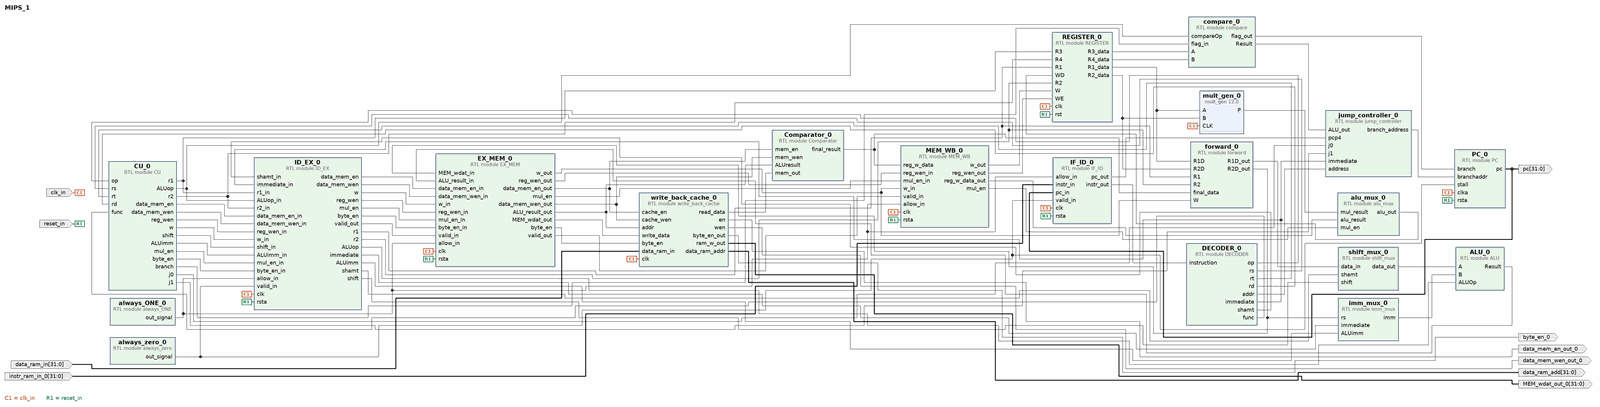
[diagram p0: block diagram of the top level, whole]
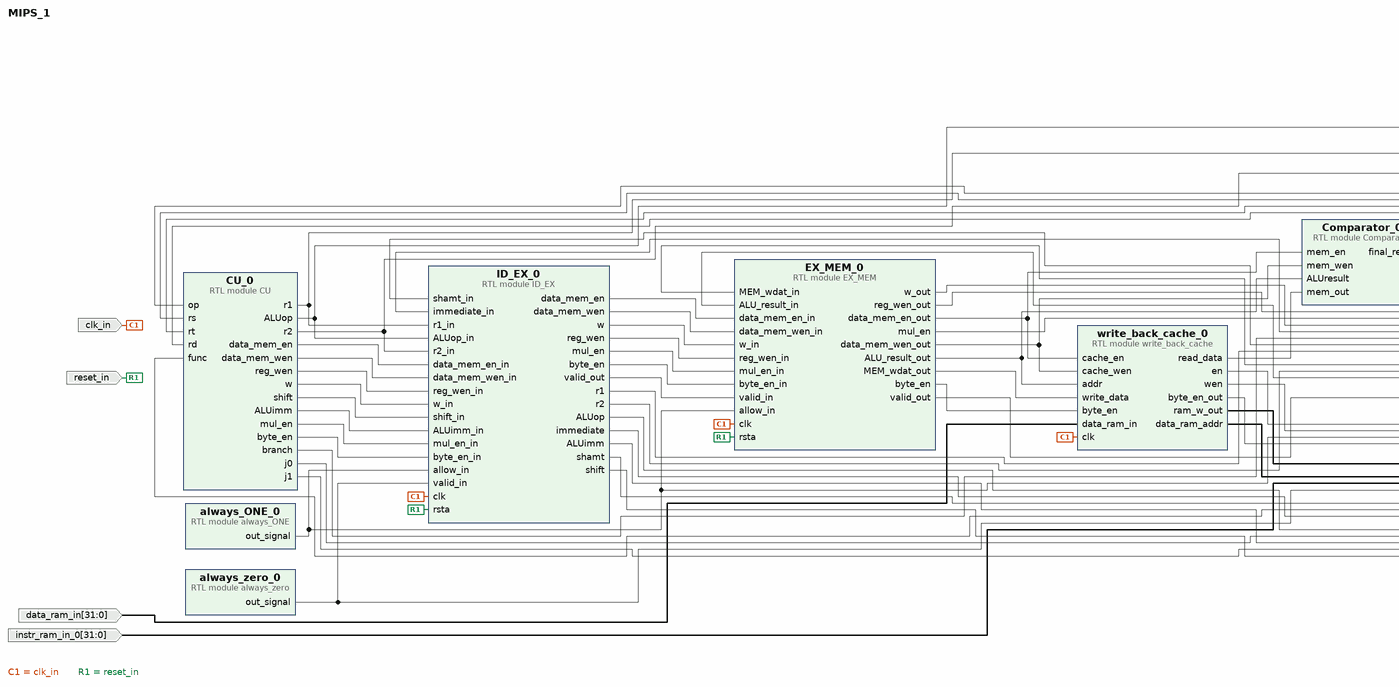
[diagram p1: block diagram of the top level, left part]
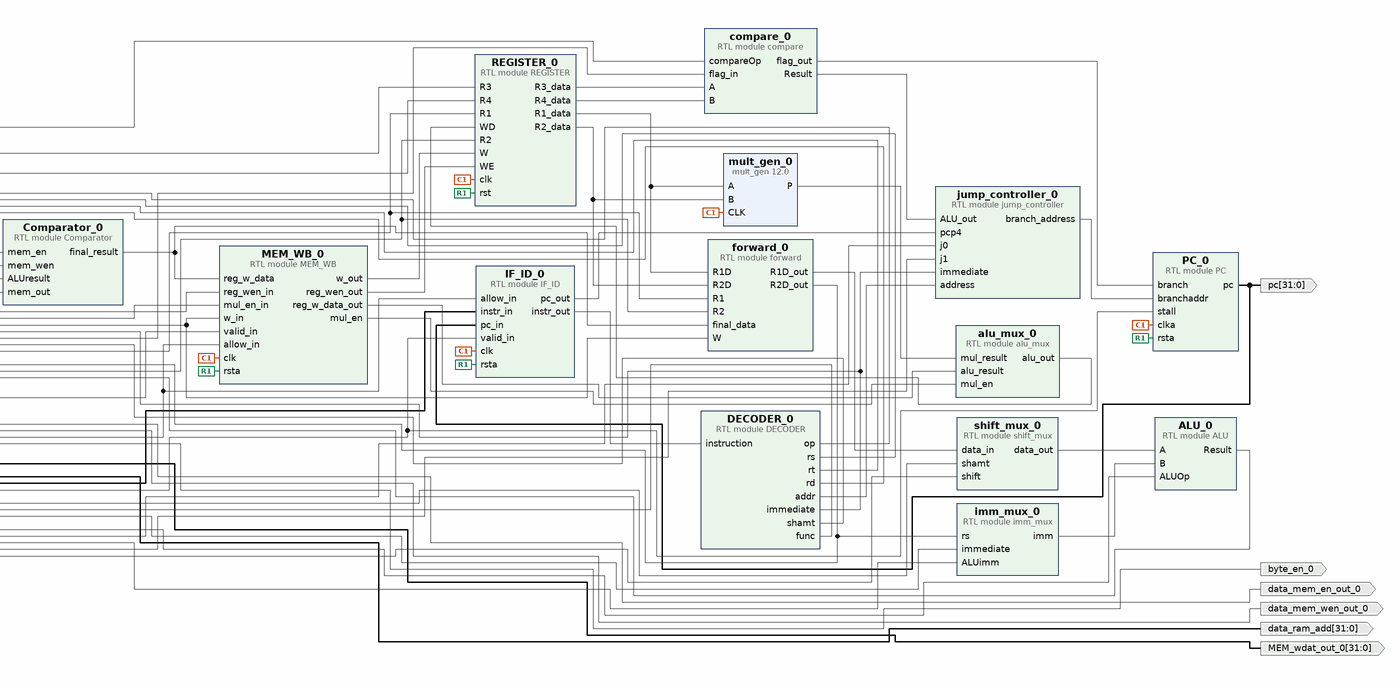
[diagram p2: block diagram of the top level, right part]
# Vivado block design MIPS_1, xc7z020clg400-2, Vivado 2018.3
create_bd_design MIPS_1

create_bd_port -dir I -type rst reset_in
set_property -dict {CONFIG.POLARITY ACTIVE_HIGH} [get_bd_ports reset_in]
create_bd_port -dir I -type clk clk_in
set_property -dict {CONFIG.FREQ_HZ 50000000} [get_bd_ports clk_in]
create_bd_port -dir O -from 31 -to 0 pc
create_bd_port -dir I -from 31 -to 0 instr_ram_in_0
create_bd_port -dir O -from 31 -to 0 data_ram_add
create_bd_port -dir I -from 31 -to 0 data_ram_in
create_bd_port -dir O -from 31 -to 0 MEM_wdat_out_0
create_bd_port -dir O data_mem_en_out_0
create_bd_port -dir O data_mem_wen_out_0
create_bd_port -dir O byte_en_0

create_bd_cell -type module -reference imm_mux imm_mux_0
create_bd_cell -type module -reference shift_mux shift_mux_0
create_bd_cell -type module -reference always_zero always_zero_0
create_bd_cell -type module -reference jump_controller jump_controller_0
create_bd_cell -type module -reference forward forward_0
create_bd_cell -type module -reference Comparator Comparator_0
create_bd_cell -type module -reference PC PC_0
create_bd_cell -type module -reference ALU ALU_0
create_bd_cell -type module -reference alu_mux alu_mux_0
create_bd_cell -type ip -vlnv xilinx.com:ip:mult_gen:12.0 mult_gen_0
set_property -dict [list \
  CONFIG.ClockEnable false \
  CONFIG.Multiplier_Construction Use_LUTs \
  CONFIG.OutputWidthHigh 31 \
  CONFIG.PipeStages 2 \
  CONFIG.PortAType Signed \
  CONFIG.PortAWidth 32 \
  CONFIG.PortBType Signed \
  CONFIG.PortBWidth 32 \
  CONFIG.Use_Custom_Output_Width true \
] [get_bd_cells mult_gen_0]
create_bd_cell -type module -reference DECODER DECODER_0
create_bd_cell -type module -reference REGISTER REGISTER_0
create_bd_cell -type module -reference CU CU_0
create_bd_cell -type module -reference write_back_cache write_back_cache_0
create_bd_cell -type module -reference always_ONE always_ONE_0
create_bd_cell -type module -reference compare compare_0
create_bd_cell -type module -reference ID_EX ID_EX_0
create_bd_cell -type module -reference MEM_WB MEM_WB_0
create_bd_cell -type module -reference IF_ID IF_ID_0
create_bd_cell -type module -reference EX_MEM EX_MEM_0

# ---- connections ----

connect_bd_net -net Clock_Gate_0_clk_out [get_bd_ports clk_in] \
  [get_bd_pins PC_0/clka] [get_bd_pins mult_gen_0/CLK] [get_bd_pins REGISTER_0/clk] [get_bd_pins write_back_cache_0/clk] \
  [get_bd_pins ID_EX_0/clk] [get_bd_pins MEM_WB_0/clk] [get_bd_pins IF_ID_0/clk] [get_bd_pins EX_MEM_0/clk]
connect_bd_net [get_bd_pins DECODER_0/op] [get_bd_pins CU_0/op]
connect_bd_net [get_bd_pins DECODER_0/rs] [get_bd_pins CU_0/rs]
connect_bd_net [get_bd_pins DECODER_0/rt] [get_bd_pins CU_0/rt]
connect_bd_net [get_bd_pins DECODER_0/rd] [get_bd_pins CU_0/rd]
connect_bd_net [get_bd_pins CU_0/data_mem_en] [get_bd_pins ID_EX_0/data_mem_en_in]
connect_bd_net [get_bd_pins CU_0/data_mem_wen] [get_bd_pins ID_EX_0/data_mem_wen_in]
connect_bd_net [get_bd_pins CU_0/reg_wen] [get_bd_pins ID_EX_0/reg_wen_in]
connect_bd_net [get_bd_pins CU_0/r1] [get_bd_pins REGISTER_0/R3] [get_bd_pins ID_EX_0/r1_in]
connect_bd_net [get_bd_pins CU_0/r2] [get_bd_pins REGISTER_0/R4] [get_bd_pins ID_EX_0/r2_in]
connect_bd_net [get_bd_pins CU_0/w] [get_bd_pins ID_EX_0/w_in]
connect_bd_net [get_bd_pins CU_0/ALUop] [get_bd_pins compare_0/compareOp] [get_bd_pins ID_EX_0/ALUop_in]
connect_bd_net [get_bd_pins CU_0/shift] [get_bd_pins ID_EX_0/shift_in]
connect_bd_net [get_bd_pins CU_0/ALUimm] [get_bd_pins ID_EX_0/ALUimm_in]
connect_bd_net [get_bd_pins DECODER_0/func] [get_bd_pins CU_0/func]
connect_bd_net [get_bd_pins DECODER_0/shamt] [get_bd_pins ID_EX_0/shamt_in]
connect_bd_net [get_bd_pins DECODER_0/immediate] [get_bd_pins jump_controller_0/immediate] [get_bd_pins ID_EX_0/immediate_in]
connect_bd_net [get_bd_pins DECODER_0/addr] [get_bd_pins jump_controller_0/address]
connect_bd_net [get_bd_pins ID_EX_0/r1] [get_bd_pins forward_0/R1] [get_bd_pins REGISTER_0/R1]
connect_bd_net [get_bd_pins ID_EX_0/r2] [get_bd_pins forward_0/R2] [get_bd_pins REGISTER_0/R2]
connect_bd_net [get_bd_pins ID_EX_0/ALUop] [get_bd_pins ALU_0/ALUOp]
connect_bd_net [get_bd_pins ID_EX_0/immediate] [get_bd_pins imm_mux_0/immediate]
connect_bd_net [get_bd_pins ID_EX_0/ALUimm] [get_bd_pins imm_mux_0/ALUimm]
connect_bd_net [get_bd_pins imm_mux_0/imm] [get_bd_pins ALU_0/B]
connect_bd_net [get_bd_pins shift_mux_0/data_out] [get_bd_pins ALU_0/A]
connect_bd_net [get_bd_pins ID_EX_0/shamt] [get_bd_pins shift_mux_0/shamt]
connect_bd_net [get_bd_pins ID_EX_0/shift] [get_bd_pins shift_mux_0/shift]
connect_bd_net [get_bd_pins ID_EX_0/data_mem_en] [get_bd_pins EX_MEM_0/data_mem_en_in]
connect_bd_net [get_bd_pins ID_EX_0/data_mem_wen] [get_bd_pins EX_MEM_0/data_mem_wen_in]
connect_bd_net [get_bd_pins ID_EX_0/w] [get_bd_pins EX_MEM_0/w_in]
connect_bd_net [get_bd_pins ID_EX_0/reg_wen] [get_bd_pins EX_MEM_0/reg_wen_in]
connect_bd_net [get_bd_pins Comparator_0/final_result] [get_bd_pins forward_0/final_data] [get_bd_pins MEM_WB_0/reg_w_data]
connect_bd_net [get_bd_pins EX_MEM_0/w_out] [get_bd_pins forward_0/W] [get_bd_pins MEM_WB_0/w_in]
connect_bd_net [get_bd_pins EX_MEM_0/reg_wen_out] [get_bd_pins MEM_WB_0/reg_wen_in]
connect_bd_net [get_bd_pins MEM_WB_0/w_out] [get_bd_pins REGISTER_0/W]
connect_bd_net [get_bd_pins MEM_WB_0/reg_wen_out] [get_bd_pins REGISTER_0/WE]
connect_bd_net [get_bd_pins IF_ID_0/instr_out] [get_bd_pins DECODER_0/instruction]
connect_bd_net [get_bd_pins always_zero_0/out_signal] [get_bd_pins PC_0/stall] [get_bd_pins ID_EX_0/valid_in] [get_bd_pins IF_ID_0/valid_in]
connect_bd_net [get_bd_pins PC_0/pc] [get_bd_ports pc] [get_bd_pins IF_ID_0/pc_in]
connect_bd_net -net instr_in_0_1 [get_bd_ports instr_ram_in_0] [get_bd_pins IF_ID_0/instr_in]
connect_bd_net [get_bd_pins EX_MEM_0/data_mem_en_out] [get_bd_pins Comparator_0/mem_en] [get_bd_pins write_back_cache_0/cache_en]
connect_bd_net [get_bd_pins EX_MEM_0/data_mem_wen_out] [get_bd_pins Comparator_0/mem_wen] [get_bd_pins write_back_cache_0/cache_wen]
connect_bd_net [get_bd_pins REGISTER_0/R1_data] [get_bd_pins forward_0/R1D] [get_bd_pins mult_gen_0/A]
connect_bd_net [get_bd_pins REGISTER_0/R2_data] [get_bd_pins forward_0/R2D] [get_bd_pins mult_gen_0/B]
connect_bd_net [get_bd_pins forward_0/R1D_out] [get_bd_pins shift_mux_0/data_in]
connect_bd_net [get_bd_pins forward_0/R2D_out] [get_bd_pins imm_mux_0/rs] [get_bd_pins EX_MEM_0/MEM_wdat_in]
connect_bd_net [get_bd_pins CU_0/mul_en] [get_bd_pins ID_EX_0/mul_en_in]
connect_bd_net [get_bd_pins ID_EX_0/mul_en] [get_bd_pins EX_MEM_0/mul_en_in]
connect_bd_net [get_bd_pins mult_gen_0/P] [get_bd_pins alu_mux_0/mul_result]
connect_bd_net [get_bd_pins IF_ID_0/pc_out] [get_bd_pins jump_controller_0/pcp4]
connect_bd_net [get_bd_pins ALU_0/Result] [get_bd_pins EX_MEM_0/ALU_result_in]
connect_bd_net [get_bd_pins CU_0/j0] [get_bd_pins jump_controller_0/j0]
connect_bd_net [get_bd_pins CU_0/j1] [get_bd_pins jump_controller_0/j1]
connect_bd_net [get_bd_pins compare_0/Result] [get_bd_pins jump_controller_0/ALU_out]
connect_bd_net [get_bd_pins REGISTER_0/R3_data] [get_bd_pins compare_0/A]
connect_bd_net [get_bd_pins REGISTER_0/R4_data] [get_bd_pins compare_0/B]
connect_bd_net [get_bd_pins CU_0/byte_en] [get_bd_pins ID_EX_0/byte_en_in]
connect_bd_net [get_bd_pins ID_EX_0/byte_en] [get_bd_pins EX_MEM_0/byte_en_in]
connect_bd_net [get_bd_pins EX_MEM_0/mul_en] [get_bd_pins MEM_WB_0/mul_en_in]
connect_bd_net [get_bd_pins MEM_WB_0/reg_w_data_out] [get_bd_pins alu_mux_0/alu_result]
connect_bd_net [get_bd_pins MEM_WB_0/mul_en] [get_bd_pins alu_mux_0/mul_en]
connect_bd_net [get_bd_pins alu_mux_0/alu_out] [get_bd_pins REGISTER_0/WD]
connect_bd_net [get_bd_ports data_ram_in] [get_bd_pins write_back_cache_0/data_ram_in]
connect_bd_net [get_bd_pins write_back_cache_0/en] [get_bd_ports data_mem_en_out_0]
connect_bd_net [get_bd_pins write_back_cache_0/wen] [get_bd_ports data_mem_wen_out_0]
connect_bd_net [get_bd_pins write_back_cache_0/byte_en_out] [get_bd_ports byte_en_0]
connect_bd_net [get_bd_pins EX_MEM_0/MEM_wdat_out] [get_bd_pins write_back_cache_0/write_data]
connect_bd_net [get_bd_pins write_back_cache_0/ram_w_out] [get_bd_ports MEM_wdat_out_0]
connect_bd_net [get_bd_pins write_back_cache_0/data_ram_addr] [get_bd_ports data_ram_add]
connect_bd_net [get_bd_ports reset_in] \
  [get_bd_pins PC_0/rsta] [get_bd_pins REGISTER_0/rst] [get_bd_pins ID_EX_0/rsta] [get_bd_pins MEM_WB_0/rsta] \
  [get_bd_pins IF_ID_0/rsta] [get_bd_pins EX_MEM_0/rsta]
connect_bd_net [get_bd_pins EX_MEM_0/byte_en] [get_bd_pins write_back_cache_0/byte_en]
connect_bd_net [get_bd_pins EX_MEM_0/ALU_result_out] [get_bd_pins Comparator_0/ALUresult] [get_bd_pins write_back_cache_0/addr]
connect_bd_net [get_bd_pins write_back_cache_0/read_data] [get_bd_pins Comparator_0/mem_out]
connect_bd_net [get_bd_pins ID_EX_0/valid_out] [get_bd_pins EX_MEM_0/valid_in]
connect_bd_net [get_bd_pins EX_MEM_0/valid_out] [get_bd_pins MEM_WB_0/valid_in]
connect_bd_net [get_bd_pins jump_controller_0/branch_address] [get_bd_pins PC_0/branchaddr]
connect_bd_net [get_bd_pins always_ONE_0/out_signal] \
  [get_bd_pins ID_EX_0/allow_in] [get_bd_pins MEM_WB_0/allow_in] [get_bd_pins IF_ID_0/allow_in] \
  [get_bd_pins EX_MEM_0/allow_in]
connect_bd_net [get_bd_pins CU_0/branch] [get_bd_pins compare_0/flag_in]
connect_bd_net [get_bd_pins compare_0/flag_out] [get_bd_pins PC_0/branch]

validate_bd_design
save_bd_design
